# EasyEDA Pro project ProPrj_smartmower_2025-07-31_08-52-16_2025-10-22.epro, schematic Schematic1
Board Name: Power; Create Date: 2025-08-06; Page Name: Power; Project Name: smartmower_2025-07-31_08-52-16; Schematic Name: Schematic1; Update Date: 2025-08-06; Company: EasyEDA.com; Page Size: A4; Version: V1.0
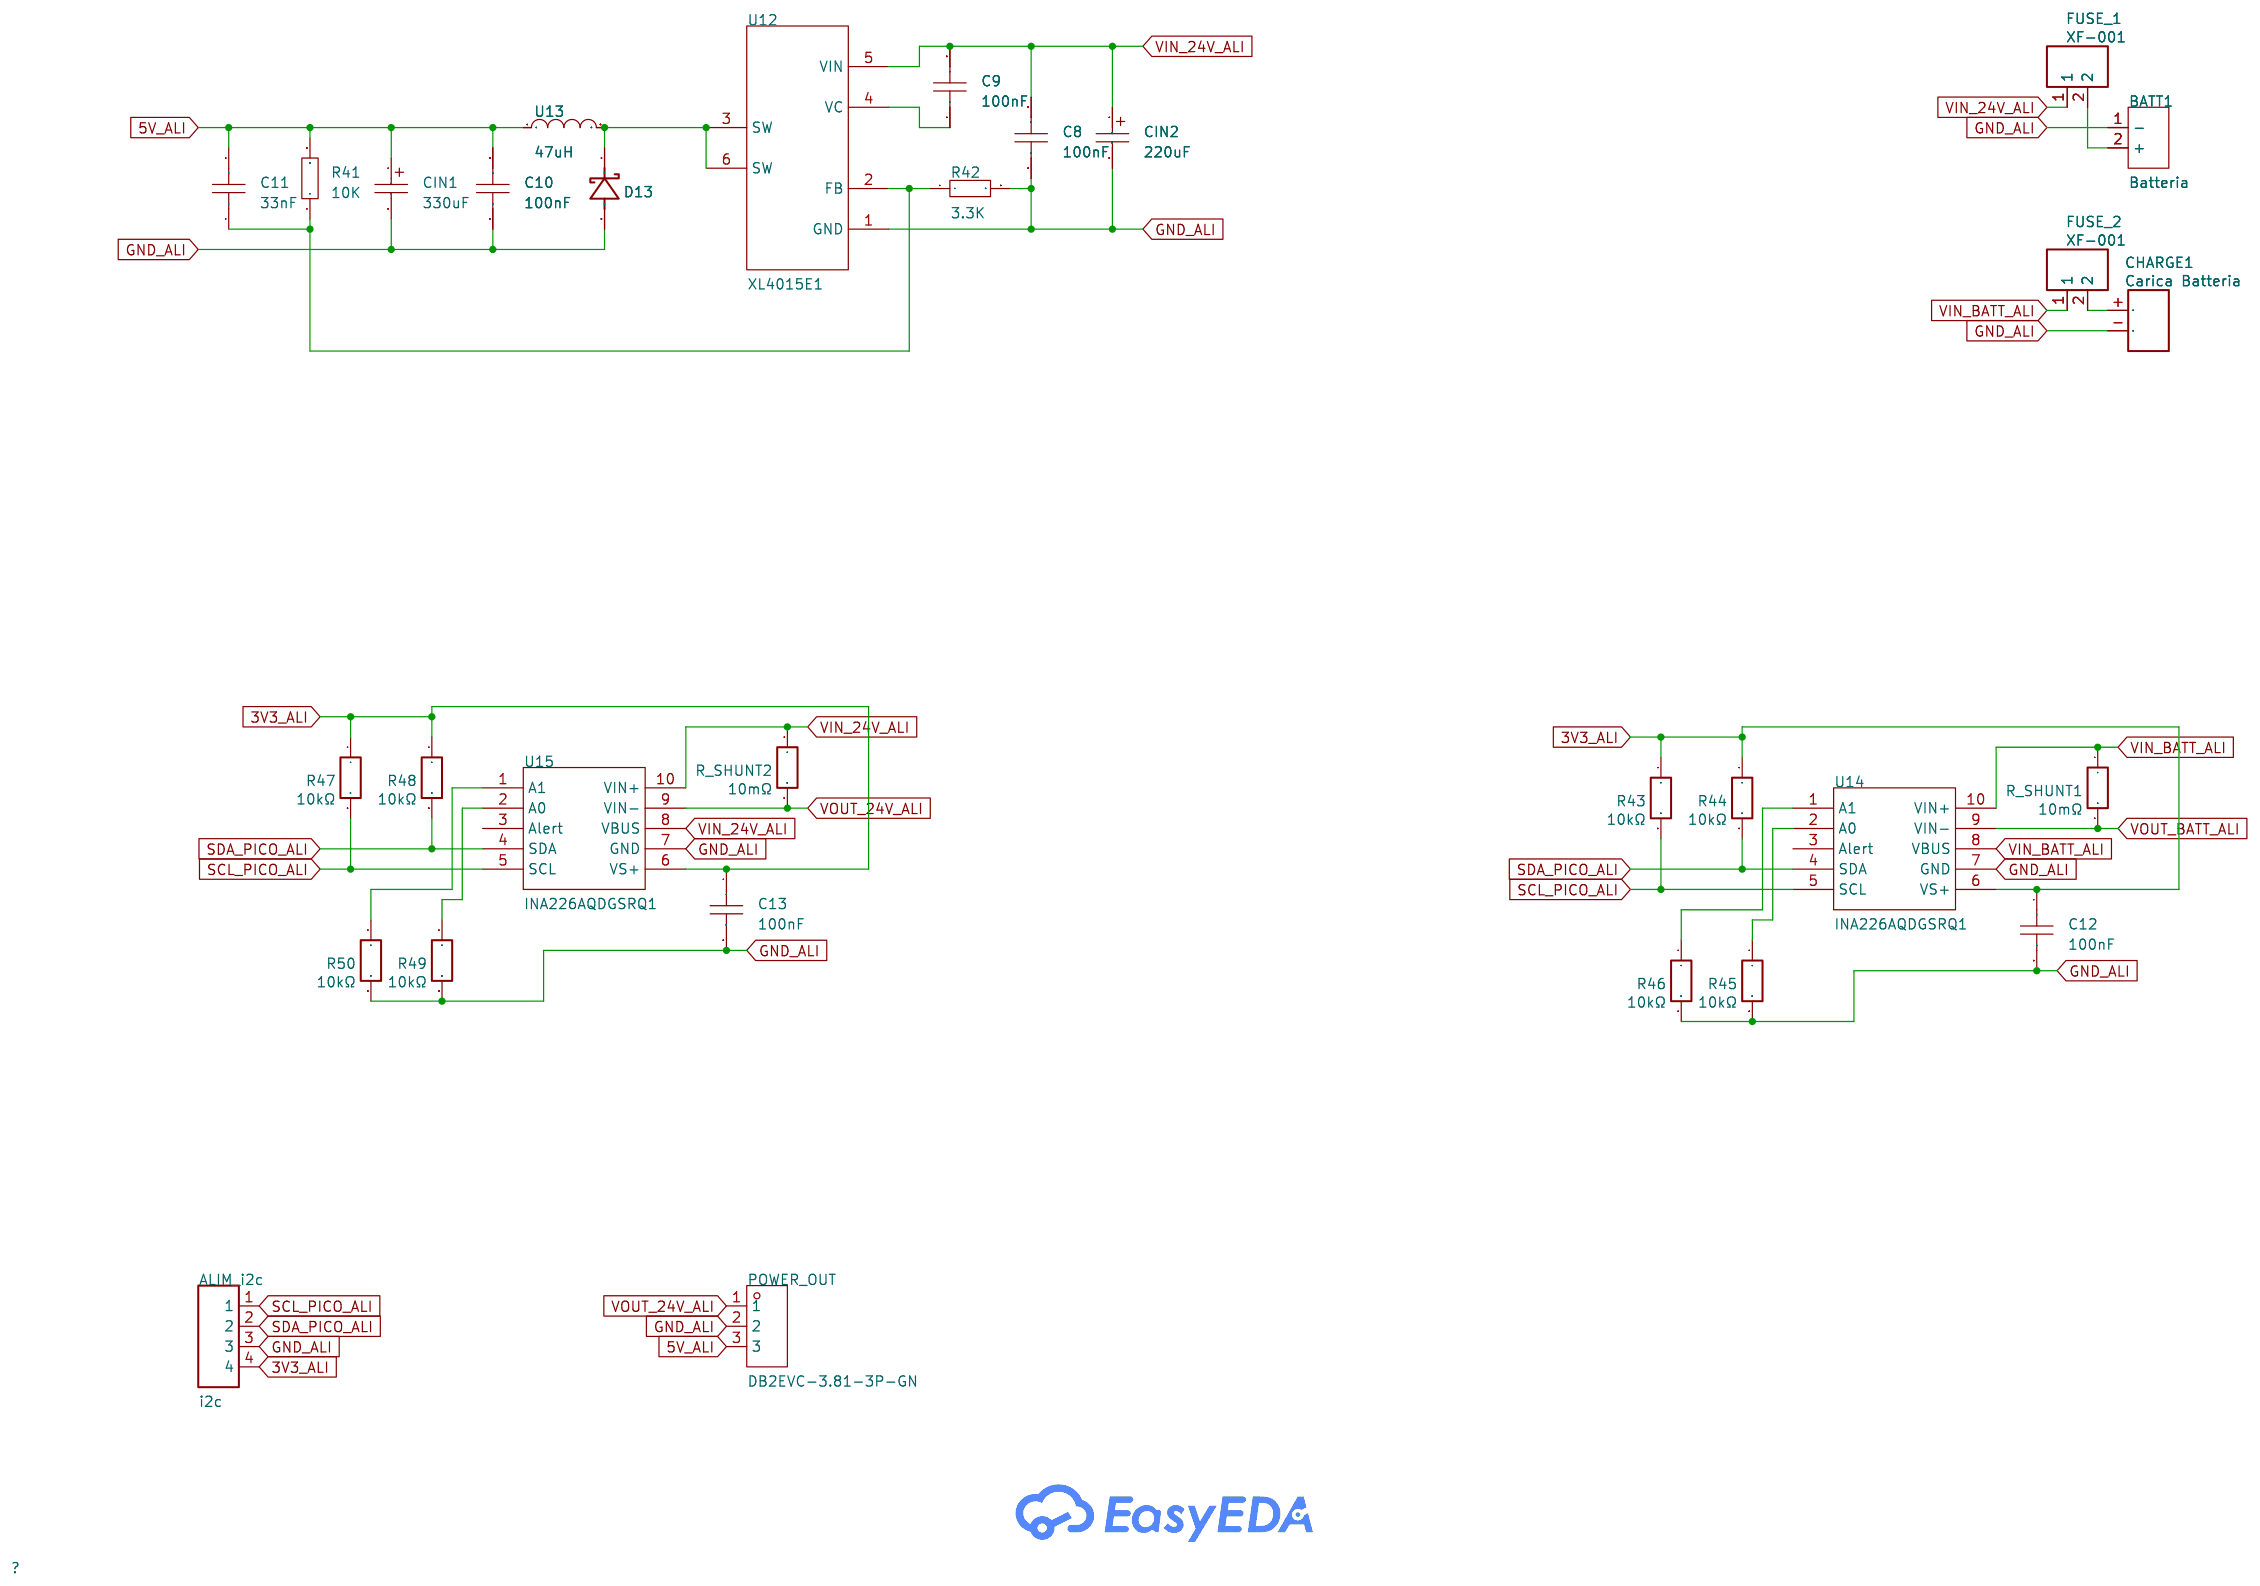
[diagram p0: schematic sheet]

## Parts
ALIM_i2c  i2c  [CONN-TH_4P-P2.50-XH2.54-4P]
BATT1  Batteria  [CONN-TH_XT60]
C8  100nF  [C0603]
C9  100nF  [C0603]
C10  100nF  [C0603]
C11  33nF  [C0603]
C12  100nF  [C0201]
C13  100nF  [C0201]
CHARGE1  Carica Batteria  [CONN-TH_XT60PB-F]
CIN1  330uF  [CAP-TH_BD8.0-P3.50-D0.6-FD]
CIN2  220uF  [CAP-TH_BD10.0-P5.00-D1.0-FD]
D13  SS54  [SMBF_L4.3-W3.6-LS5.3-RD]
FUSE_1  XF-001  [CONN-TH_XF-001]
FUSE_2  XF-001  [CONN-TH_XF-001]
POWER_OUT  DB2EVC-3.81-3P-GN  [CONN-TH_3P-P3.81_DB2EVC-3.81-3P]
R41  10K  [R0603]
R42  3.3K  [R0603]
R43  10kΩ  [R0603]
R44  10kΩ  [R0603]
R45  10kΩ  [R0603]
R46  10kΩ  [R0603]
R47  10kΩ  [R0603]
R48  10kΩ  [R0603]
R49  10kΩ  [R0603]
R50  10kΩ  [R0603]
R_SHUNT1  10mΩ  [R2512]
R_SHUNT2  10mΩ  [R2512]
U12  XL4015E1  [TO-263-5_L10.2-W8.9-P1.70-TL]
U13  47uH  [IND-SMD_L11.6-W10.1]
U14  INA226AQDGSRQ1  [VSSOP-10_L3.0-W3.0-P0.50-LS4.9-BL]
U15  INA226AQDGSRQ1  [VSSOP-10_L3.0-W3.0-P0.50-LS4.9-BL]

## Library data of the parts
ALIM_i2c = i2c: Supplier: LCSC; Supplier Part: C5151117; Manufacturer: CNJM(九木精密); Manufacturer Part: CNJMA2501WV-4P; JLCPCB Part Class: Extended Part; Contributor: lcsc; spicePre: U; spiceSymbolName: CNJMA2501WV-4P
BATT1 = XT60-M.: Power:- Output:- Input:- Size:- Interface:- Type:- Colour:Yellow MaximumCurrent:- Type:Banana Connector RatedVoltage:- Type1:- NumberOfUSBHoles:- InterfaceType:Male MetalMaterial:- InsulationMaterial:- RatedCurrent:- RecommendedWireGauge:- FlameRetardantG; LCSC Part Name: AMASS(艾迈斯) XT60模型插头 3.5mm镀金香蕉头公头（电调端）XT60-M; Supplier Part: C98733; Manufacturer: AMASS(艾迈斯); JLCPCB Part Class: Extended Part; Datasheet: https://atta.szlcsc.com/upload/public/pdf/source/20170606/1496716524919.pdf; Supplier: LCSC; Type: Banana Connector; Colour: Yellow; InterfaceType: Male; specifications: 3.5mm
C8-C11 = CC0603KRX7R9BB104: Capacitance:100nF Tolerance:±10% Tolerance:±10% Voltage Rating:50V Temperature Coefficient:X7R; LCSC Part Name: 100nF ±10% 50V; Supplier Part: C14663; Manufacturer: YAGEO(国巨); Supplier Footprint: 0603; JLCPCB Part Class: Basic Part; Datasheet: https://atta.szlcsc.com/upload/public/pdf/source/20250214/096C4C206003071F5D32E5F0D8E7F8DF.pdf; Supplier: LCSC; Tolerance: ±10%; Voltage Rating: 50V; Temperature Coefficient: X7R
C12 C13 = GRM033R61A104KE15D: Capacitance: Tolerance:±10% Tolerance:±10% Voltage Rated: Temperature Coefficient:; LCSC Part Name: 100nF ±10% 10V; Supplier Part: C76934; Manufacturer: muRata(村田); Supplier Footprint: 0201; JLCPCB Part Class: Extended Part; Datasheet: https://atta.szlcsc.com/upload/public/pdf/source/20180307/C76934_15204090982891407723.pdf; Supplier: LCSC; Tolerance: ±10%
CHARGE1 = Carica Batteria: Supplier: LCSC; Supplier Part: C98734; Manufacturer: AMASS(艾迈斯); Manufacturer Part: XT60-F; JLCPCB Part Class: Extended Part; Contributor: lcsc; spicePre: U; spiceSymbolName: XT60-F
CIN1 = ERG25V330M8X12: Capacitance:330uF Tolerance:±20% Tolerance:±20% Voltage Rating:25V Ripple Current:760mA@100kHz Equivalent Series Resistance(ESR):87mΩ@100kHz Pin Spacing:3.5mm Diameter:8mm Height - Seated (Max):12mm Lifetime:2000hrs@105℃ Operating Temperature:-40℃~+105℃ O; LCSC Part Name: 330uF ±20% 25V; Supplier Part: C47344178; Manufacturer: 捷而瑞; Supplier Footprint: 插件,D8xL12mm; JLCPCB Part Class: Extended Part; Datasheet: https://atta.szlcsc.com/upload/public/pdf/source/20250526/717B4C76834FE5C4A331D19A222D031C.pdf; Supplier: LCSC; Tolerance: ±20%; Voltage Rating: 25V; Ripple Current: 760mA@100kHz; Equivalent Series Resistance(ESR): 87mΩ@100kHz; Pin Spacing: 3.5mm; Diameter: 8mm; Height - Seated (Max): 12mm; Lifetime: 2000hrs@105℃; Operating Temperature: -40℃~+105℃
CIN2 = SHG220UF50V01EC1210: Capacitance:220uF Tolerance:±20% Tolerance:±20% Voltage Rating:50V Ripple Current:- Equivalent Series Resistance(ESR):- Pin Spacing:- Diameter:10mm Height - Seated (Max):13mm Lifetime:10000hrs@105℃ Operating Temperature:- Operating Temperature:-; LCSC Part Name: 220uF ±20% 50V; Supplier Part: C3034843; Manufacturer: KNSCHA(科尼盛); Supplier Footprint: 插件,D10xL13mm; JLCPCB Part Class: Extended Part; Datasheet: https://atta.szlcsc.com/upload/public/pdf/source/20220617/36D31AEAEF6296A4AEDCFFF7060A6D59.pdf; Supplier: LCSC; Tolerance: ±20%; Voltage Rating: 50V; Diameter: 10mm; Height - Seated (Max): 13mm; Lifetime: 10000hrs@105℃
D13 = SS54_C970945: Diode Configuration:Independent Type Voltage - Forward(Vf@If):550mV@5A Voltage - DC Reverse(Vr):40V Current - Rectified:5A Reverse Leakage Current (Ir):500uA@40V; LCSC Part Name: 电压:40V 电流:5A; Supplier Part: C970945; Manufacturer: LGE(鲁光); Supplier Footprint: SMBF; JLCPCB Part Class: Extended Part; Datasheet: https://atta.szlcsc.com/upload/public/pdf/source/20201217/C970945_54BBDC77FA778A032CE282DEB5732864.pdf; Supplier: LCSC; Diode Configuration: Independent Type; Voltage - Forward(Vf@If): 550mV@5A; Voltage - DC Reverse(Vr): 40V; Current - Rectified: 5A; Reverse Leakage Current (Ir): 500uA@40V
FUSE_1 FUSE_2 = XF-001: Supplier: LCSC; Supplier Part: C17700140; Manufacturer: XFCN(兴飞); JLCPCB Part Class: Extended Part; Contributor: lcsc; spicePre: U
POWER_OUT = DB2EVC-3.81-3P-GN: Connector Type:Board Side/Socket - Closed Number of Positions or Pins:1x3P Pitch:3.81mm Color:Green Mounting Type:Straight Pin Number of Pins:3P Number of Rows:1 Number of PINs Per Row:3 Current Rating:10A Voltage Rating (Max):250V Operating Temperature:-; LCSC Part Name: 3.81mm 1x3P 排数:1 每排P数:3; Supplier Part: C395692; Manufacturer: DORABO(地博电气); Supplier Footprint: 插件,P=3.81mm; JLCPCB Part Class: Extended Part; Datasheet: https://atta.szlcsc.com/upload/public/pdf/source/20230106/E295F87ABDAA44E449E4D4A582259339.pdf; Supplier: LCSC; Connector Type: Board Side/Socket - Closed; Number of Positions or Pins: 1x3P; Pitch: 3.81mm; Color: Green; Mounting Type: Straight Pin; Number of Pins: 3P; Number of Rows: 1; Number of PINs Per Row: 3; Current Rating: 10A; Voltage Rating (Max): 250V; Operating Temperature: -40℃~+105℃
R41 R42 = Res_0603: Supplier Footprint: 0603
R43-R50 = SCR0603J10K: Type:Thick Film Resistors Resistance: Tolerance:±5% Tolerance:±5% Power(Watts): Overload Voltage (Max): Operating Temperature Range:-55℃~+155℃ Operating Temperature Range:-55℃~+155℃; LCSC Part Name: 厚膜电阻 10kΩ ±5% 100mW; Supplier Part: C3017715; Manufacturer: VO(翔胜); Supplier Footprint: 0603; JLCPCB Part Class: Extended Part; Datasheet: https://atta.szlcsc.com/upload/public/pdf/source/20220513/247AF9639BA21CF93567DC289CCC6A22.pdf; Supplier: LCSC; Type: Thick Film Resistors; Tolerance: ±5%; Operating Temperature Range: -55℃~+155℃
R_SHUNT1 R_SHUNT2 = RLP25FEGR010: Resistance:10mΩ Tolerance:±1% Tolerance:±1% Power(Watts):3W Temperature Coefficient:±50ppm/℃ Temperature Coefficient:±50ppm/℃; LCSC Part Name: 10mΩ ±1% 3W; Supplier Part: C393070; Manufacturer: 大毅科技; Supplier Footprint: 2512; JLCPCB Part Class: Extended Part; Datasheet: https://atta.szlcsc.com/upload/public/pdf/source/20191209/C467441_D59F70B0A5C6980F35DB1CB3CCA97CC4.pdf; Supplier: LCSC; Tolerance: ±1%; Power(Watts): 3W; Temperature Coefficient: ±50ppm/℃
U12 = XL4015E1: Function:Buck Output Type:Adjustable Voltage - Supply:8V~36V Voltage - Supply:8V~36V Output Voltage:1.25V~32V Output Voltage:1.25V~32V Output Current:5A Frequency - Switching:180kHz Frequency - Switching:180kHz Operating Temperature:-40℃~+125℃ Operating T; LCSC Part Name: 5A 180KHz 36V 降压型DC-DC转换器; Supplier Part: C51661; Manufacturer: XLSEMI(芯龙); Supplier Footprint: TO-263-5; JLCPCB Part Class: Extended Part; Datasheet: https://atta.szlcsc.com/upload/public/pdf/source/20250109/4BED35EECA130A9C007A6498C0DD05D8.pdf; Supplier: LCSC; Function: Buck; Output Type: Adjustable; Voltage - Supply: 8V~36V; Output Voltage: 1.25V~32V; Output Current: 5A; Frequency - Switching: 180kHz; Operating Temperature: -40℃~+125℃; Synchronous Rectifier: Yes; Number of Outputs: 1; Topology: Buck; Quiescent Current: 5mA; Switch tube (built-in/external): Built-in
U13 = CYA1050-47UH: Inductance: Tolerance:±20% Tolerance:±20% Rated Current: Saturation Current (Isat):5A DC Resistance (DCR):; LCSC Part Name: 47uH ±20% 5A; Supplier Part: C7529419; Manufacturer: SHOU HAN(首韩); Supplier Footprint: SMD,11.6x10.1mm; JLCPCB Part Class: Extended Part; Datasheet: https://atta.szlcsc.com/upload/public/pdf/source/20230818/3A9696E91D49CEDD839FD5A32BFADEE6.pdf; Supplier: LCSC; Tolerance: ±20%; Saturation Current (Isat): 5A
U14 U15 = INA226AQDGSRQ1: LCSC Part Name: 汽车级36V双向零漂移高精度低侧/高侧I2C兼容电流/功率监视器; Supplier Part: C2653835; Manufacturer: TI(德州仪器); Supplier Footprint: VSSOP-10-0.5mm; JLCPCB Part Class: Extended Part; Datasheet: https://www.ti.com/cn/lit/gpn/ina226-q1; Supplier: LCSC

## Nets
3V3_ALI: ALIM_i2c.4 C12.1 C13.1 R43.1 R44.1 R47.1 R48.1 U14.6(VS+) U15.6(VS+)
5V_ALI: C10.2 C11.2 CIN1.1 POWER_OUT.3 R41.2 U13.1
GND_ALI: ALIM_i2c.3 BATT1.1(-) C8.1 C10.1 C12.2 C13.2 CHARGE1.-(2) CIN1.2 CIN2.2 D13.2(A) POWER_OUT.2 R42.2 R45.2 R46.2 R49.2 R50.2 U12.1(GND) U14.7(GND) U15.7(GND)
VIN_24V_ALI: C8.2 C9.2 CIN2.1 FUSE_1.1 R_SHUNT2.1 U12.5(VIN) U15.8(VBUS) U15.10(VIN+)
VIN_BATT_ALI: FUSE_2.1 R_SHUNT1.1 U14.8(VBUS) U14.10(VIN+)
SCL_PICO_ALI: ALIM_i2c.1 R43.2 R47.2 U14.5(SCL) U15.5(SCL)
SDA_PICO_ALI: ALIM_i2c.2 R44.2 R48.2 U14.4(SDA) U15.4(SDA)
VOUT_24V_ALI: POWER_OUT.1 R_SHUNT2.2 U15.9(VIN-)
VOUT_BATT_ALI: R_SHUNT1.2 U14.9(VIN-)
$2N487: C9.1 U12.4(VC)
$2N488: D13.1(K) U12.3(SW) U12.6(SW) U13.2
$2N491: C11.1 R41.1 R42.1 U12.2(FB)
$2N666: BATT1.2(+) FUSE_1.2
$2N668: CHARGE1.+(1) FUSE_2.2
$2N1021: R46.1 U14.1(A1)
$2N1022: R45.1 U14.2(A0)
$2N1377: R50.1 U15.1(A1)
$2N1378: R49.1 U15.2(A0)

Not connected (* = marked no-connect by the designer): U14 3(Alert); U15 3(Alert)
